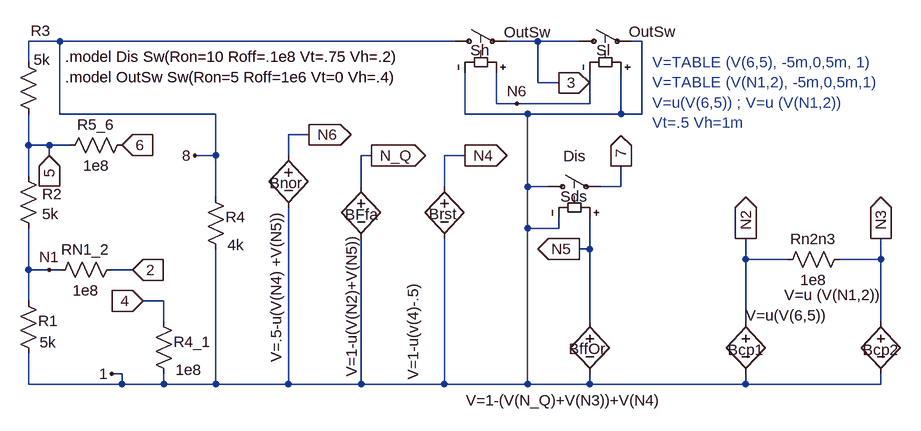
[diagram p0: schematic 6B3Sw555.asc]
6B3Sw555.asc, the LTspice schematic file:
Version 4
SHEET 1 1152 916
WIRE -576 128 -576 96
WIRE -576 256 -576 208
WIRE -576 304 -576 256
WIRE -576 448 -576 384
WIRE -576 496 -576 448
WIRE -576 624 -576 576
WIRE -544 256 -576 256
WIRE -544 272 -544 256
WIRE -544 448 -576 448
WIRE -528 96 -576 96
WIRE -528 208 -528 96
WIRE -528 448 -544 448
WIRE -512 256 -544 256
WIRE -432 608 -448 608
WIRE -432 624 -576 624
WIRE -432 624 -432 608
WIRE -416 448 -448 448
WIRE -368 496 -400 496
WIRE -368 528 -368 496
WIRE -368 624 -432 624
WIRE -368 624 -368 608
WIRE -288 208 -528 208
WIRE -288 272 -320 272
WIRE -288 272 -288 208
WIRE -288 336 -288 272
WIRE -288 624 -368 624
WIRE -288 624 -288 416
WIRE -176 272 -176 240
WIRE -176 624 -288 624
WIRE -176 624 -176 352
WIRE -144 240 -176 240
WIRE -64 320 -64 272
WIRE -64 624 -176 624
WIRE -64 624 -64 400
WIRE -48 272 -64 272
WIRE 64 320 64 272
WIRE 64 624 -64 624
WIRE 64 624 64 400
WIRE 80 96 -528 96
WIRE 96 208 96 144
WIRE 96 272 64 272
WIRE 144 192 144 144
WIRE 176 192 144 192
WIRE 192 208 96 208
WIRE 192 320 192 208
WIRE 192 384 192 320
WIRE 192 624 64 624
WIRE 192 624 192 384
WIRE 208 96 160 96
WIRE 208 160 208 96
WIRE 224 320 192 320
WIRE 240 160 208 160
WIRE 240 384 192 384
WIRE 240 384 240 368
WIRE 272 96 208 96
WIRE 288 192 176 192
WIRE 288 192 288 144
WIRE 288 416 272 416
WIRE 288 416 288 368
WIRE 288 528 288 416
WIRE 288 624 192 624
WIRE 288 624 288 608
WIRE 336 208 192 208
WIRE 336 208 336 144
WIRE 336 320 304 320
WIRE 336 320 336 288
WIRE 368 96 352 96
WIRE 368 208 336 208
WIRE 368 208 368 96
WIRE 528 432 528 400
WIRE 528 528 528 432
WIRE 528 624 288 624
WIRE 528 624 528 608
WIRE 592 432 528 432
WIRE 736 432 672 432
WIRE 736 432 736 400
WIRE 736 528 736 432
WIRE 736 624 528 624
WIRE 736 624 736 608
FLAG -544 448 N1
FLAG -544 272 5
IOPIN -544 272 In
FLAG 336 288 7
IOPIN 336 288 Out
FLAG -320 272 8
FLAG 240 160 3
IOPIN 240 160 Out
FLAG 176 192 N6
FLAG -448 608 1
FLAG -400 496 4
IOPIN -400 496 In
FLAG -432 256 6
IOPIN -432 256 In
FLAG 528 400 N2
IOPIN 528 400 Out
FLAG -416 448 2
IOPIN -416 448 In
FLAG 736 400 N3
IOPIN 736 400 Out
FLAG -144 240 N6
IOPIN -144 240 Out
FLAG -48 272 N_Q
IOPIN -48 272 Out
FLAG 272 416 N5
IOPIN 272 416 Out
FLAG 96 272 N4
IOPIN 96 272 Out
SYMBOL res -592 480 R0
WINDOW 0 31 47 Left 0
WINDOW 3 33 80 Left 0
SYMATTR InstName R1
SYMATTR Value 5k
SYMBOL res -592 288 R0
WINDOW 0 37 43 Left 0
WINDOW 3 37 74 Left 0
SYMATTR InstName R2
SYMATTR Value 5k
SYMBOL res -592 112 R0
WINDOW 0 19 -32 Left 0
WINDOW 3 24 12 Left 0
SYMATTR InstName R3
SYMATTR Value 5k
SYMBOL sw 208 320 R270
WINDOW 0 -15 35 VRight 0
WINDOW 3 47 39 VRight 0
SYMATTR InstName Sds
SYMATTR Value Dis
SYMBOL sw 64 96 R270
WINDOW 0 -14 40 VRight 0
WINDOW 3 14 92 VRight 0
SYMATTR InstName Sh
SYMATTR Value OutSw
SYMBOL sw 256 96 R270
WINDOW 0 -14 42 VRight 0
WINDOW 3 15 92 VRight 0
SYMATTR InstName Sl
SYMATTR Value OutSw
SYMBOL res -304 320 R0
WINDOW 0 31 47 Left 0
WINDOW 3 34 90 Left 0
SYMATTR InstName R4
SYMATTR Value 4k
SYMBOL res 576 448 R270
WINDOW 0 32 56 VTop 0
WINDOW 3 0 56 VBottom 0
SYMATTR InstName Rn2n3
SYMATTR Value 1e8
SYMBOL res -544 464 R270
WINDOW 0 32 56 VTop 0
WINDOW 3 0 56 VBottom 0
SYMATTR InstName RN1_2
SYMATTR Value 1e8
SYMBOL bv 528 512 R0
WINDOW 0 -28 59 Left 0
WINDOW 3 126 6 Right 0
SYMATTR InstName Bcp1
SYMATTR Value V=u(V(6,5))
SYMBOL bv 736 512 R0
WINDOW 0 -28 59 Left 0
WINDOW 3 -149 -25 Left 0
SYMATTR InstName Bcp2
SYMATTR Value V=u (V(N1,2))
SYMBOL bv -176 256 R0
WINDOW 0 -29 58 Left 0
WINDOW 3 -19 99 VRight 0
SYMATTR InstName Bnor
SYMATTR Value V=.5-u(V(N4) +V(N5))
SYMBOL bv -64 304 R0
WINDOW 0 -25 59 Left 0
WINDOW 3 -15 87 VRight 0
SYMATTR InstName BFfa
SYMATTR Value V=1-u(V(N2)+V(N5))
SYMBOL bv 64 304 R0
WINDOW 0 -24 58 Left 0
WINDOW 3 -48 314 VLeft 0
SYMATTR InstName Brst
SYMATTR Value V=1-u(v(4)-.5)
SYMBOL res -416 240 R90
WINDOW 0 0 56 VBottom 0
WINDOW 3 32 56 VTop 0
SYMATTR InstName R5_6
SYMATTR Value 1e8
SYMBOL bv 288 512 R0
WINDOW 0 -32 58 Left 0
WINDOW 3 -191 137 Left 0
SYMATTR InstName BffOr
SYMATTR Value V=1-(V(N_Q)+V(N3))+V(N4)
SYMBOL res -384 512 R0
WINDOW 0 31 47 Left 0
WINDOW 3 34 90 Left 0
SYMATTR InstName R4_1
SYMATTR Value 1e8
TEXT -520 120 Left 0 !.model Dis Sw(Ron=10 Roff=.1e8 Vt=.75 Vh=.2)\n.model OutSw Sw(Ron=5 Roff=1e6 Vt=0 Vh=.4)
TEXT 384 128 Left 0 ;V=TABLE (V(6,5), -5m,0,5m, 1)\nV=TABLE (V(N1,2), -5m,0,5m,1)\nV=u(V(6,5)) ; V=u (V(N1,2))\nVt=.5 Vh=1m

The netlist it stands for:
* 6B3Sw555.asc
R1 N1 1 5k
R2 5 N1 5k
R3 8 5 5k
Sds 1 7 N5 1 Dis
Sh 8 3 N6 1 OutSw
Sl 3 1 1 N6 OutSw
R4 8 1 4k
Rn2n3 N2 N3 1e8
RN1_2 N1 2 1e8
Bcp1 N2 1 V=u(V(6,5))
Bcp2 N3 1 V=u (V(N1,2))
Bnor N6 1 V=.5-u(V(N4) +V(N5))
BFfa N_Q 1 V=1-u(V(N2)+V(N5))
Brst N4 1 V=1-u(v(4)-.5)
R5_6 6 5 1e8
BffOr N5 1 V=1-(V(N_Q)+V(N3))+V(N4)
R4_1 4 1 1e8
.model Dis Sw(Ron=10 Roff=.1e8 Vt=.75 Vh=.2)
.model OutSw Sw(Ron=5 Roff=1e6 Vt=0 Vh=.4)
* V=TABLE (V(6,5), -5m,0,5m, 1)
* V=TABLE (V(N1,2), -5m,0,5m,1)
* V=u(V(6,5)) ; V=u (V(N1,2))
* Vt=.5 Vh=1m
.backanno
.end